# EAGLE schematic New (EAGLE 6.5.0)
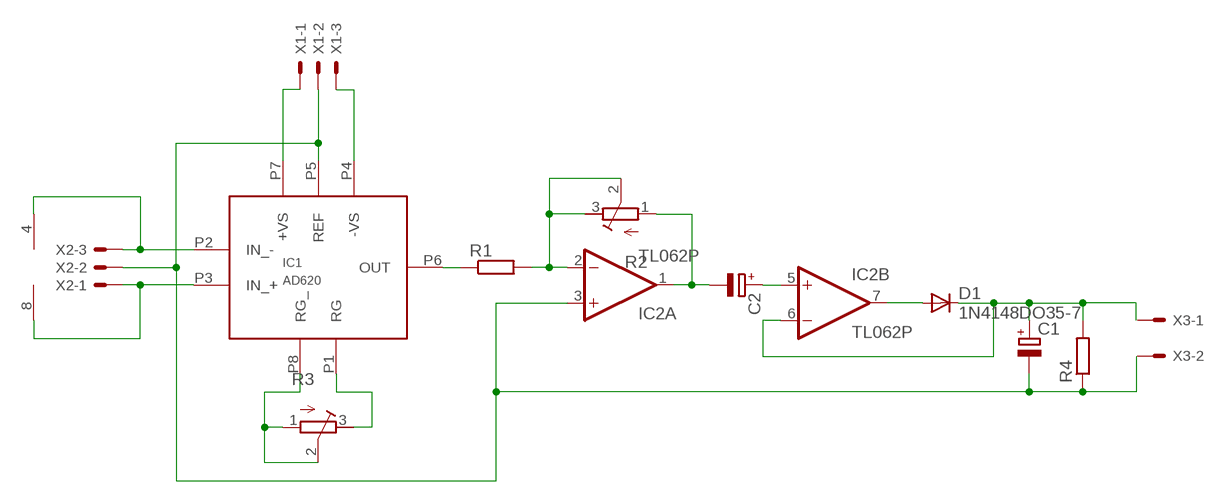
[diagram p0: schematic, sheet 1]

## Parts
C1  CPOL-EUB45181A  [B45181A]
C2  CPOL-EUB45181A  [B45181A]
D1  1N4148DO35-7  [DO35-7]
IC1  AD620  [DIL8]
IC2  TL062P  [DIL08]
R1  R-EU_0207/10  [0207/10]
R2  R-TRIMM64Z  [RTRIM64Z]
R3  R-TRIMM64Z  [RTRIM64Z]
R4  R-EU_0207/10  [0207/10]
X1  KK-156-3  [KK-156-3]
X2  KK-156-3  [KK-156-3]
X3  KK-156-2  [KK-156-2]

## Nets
N$1: IC1.P6(OUT) R1.1
N$2: IC2.2(A:-IN) R1.2 R2.2(S) R2.3(E)
N$3: C2.- IC2.1(A:OUT) R2.1(A)
N$4: IC1.P8(RG_) R3.1(A) R3.2(S)
N$5: IC1.P1(RG) R3.3(E)
N$6: C1.+ D1.C IC2.6(B:-IN) R4.2
N$7: C2.+ IC2.5(B:+IN)
N$8: IC1.P7(+VS) X1.1
N$9: IC1.P4(-VS) X1.3
N$10: IC1.P2(IN_-) IC2.4(P:V-) X2.3
N$11: IC1.P3(IN_+) IC2.8(P:V+) X2.1
N$12: D1.A IC2.7(B:OUT)
N$15: C1.- IC1.P5(REF) IC2.3(A:+IN) R4.1 X1.2 X2.2
Unconnected: X3.1 X3.2

## Library data of the parts
C1 C2 = rcl:CPOL-EU: POLARIZED CAPACITOR, European symbol
D1 = diode:1N4148: DIODE high speed (Philips)
IC1 = ad620:AD620
IC2 = linear:TL062: OP AMP
R1 R4 = rcl:R-EU_: RESISTOR, European symbol
R2 R3 = rcl:R-TRIMM: Trimm resistor
X1 X2 = con-molex:KK-156-3: KK 156 HEADER Source: http://www.molex.com/pdm_docs/sd/026604100_sd.pdf; OC_FARNELL: unknown; OC_NEWARK: unknown
X3 = con-molex:KK-156-2: KK 156 HEADER Source: http://www.molex.com/pdm_docs/sd/026604100_sd.pdf; OC_FARNELL: unknown; OC_NEWARK: unknown